# Altium project KEYDIY.PRJPCB
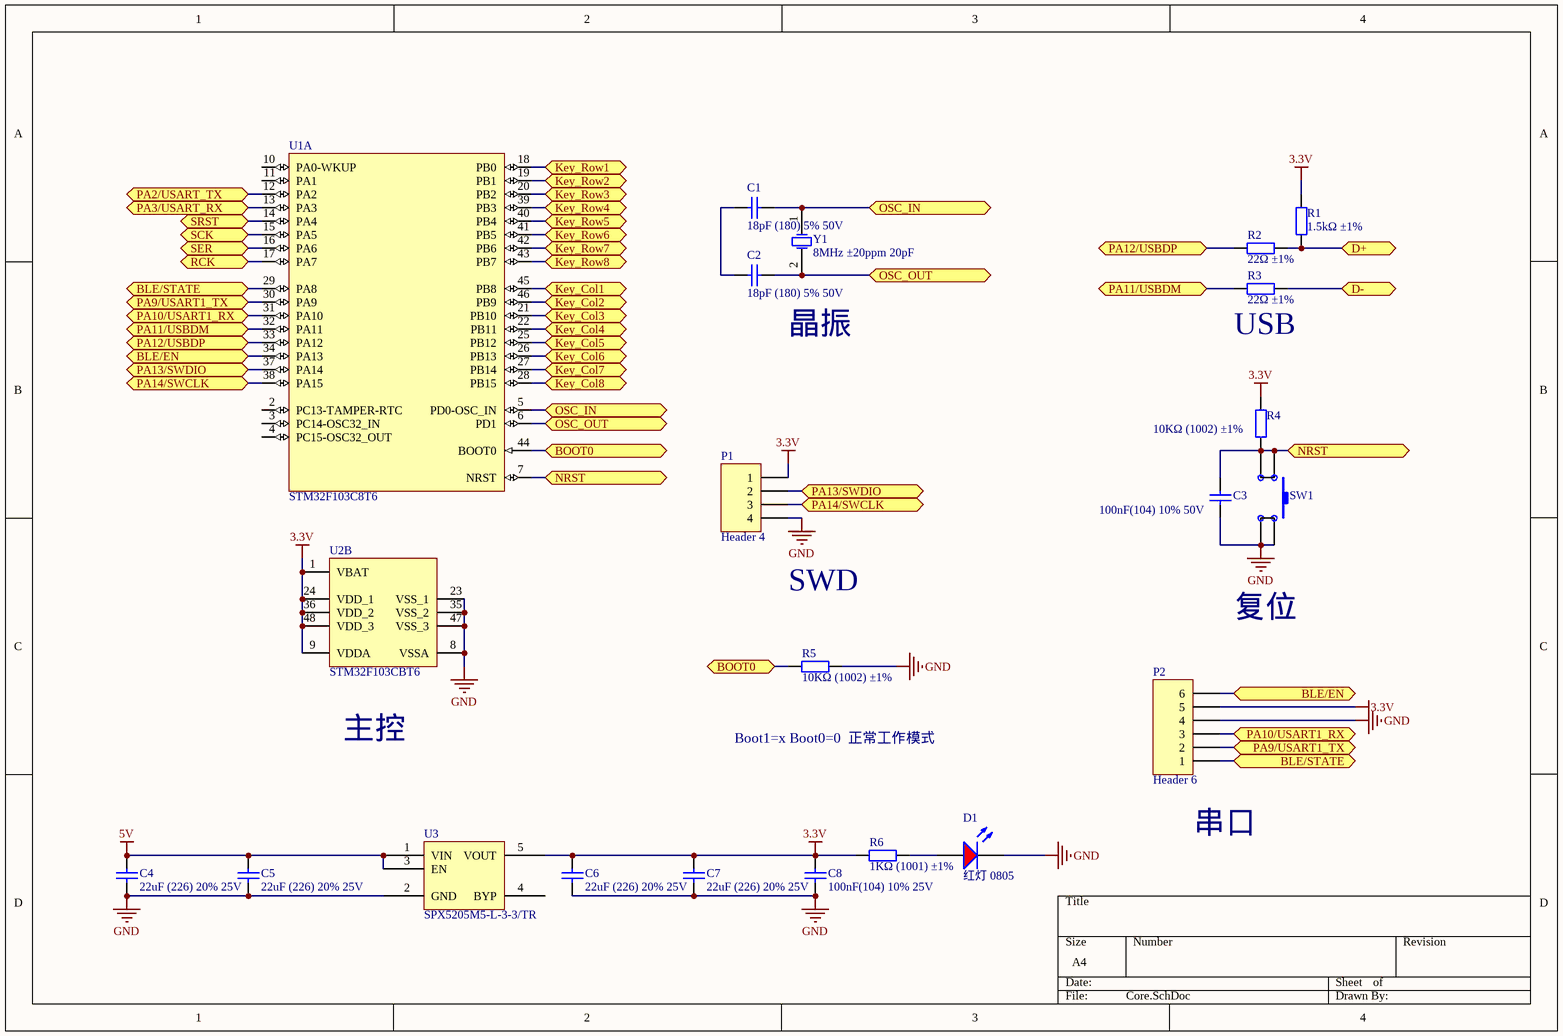
[diagram p0: Core.SchDoc]
2 sheets, 223 parts. Net scope: flat (ports and power ports of the same name join across sheets).
Board file: KeyDiy.PcbDoc
Sheets:
  Core.SchDoc
  KeyDiy.SchDoc

## Sheet Core.SchDoc
size A4

### Parts
(Parts that share a designator on the sheet are numbered #1, #2 ... from top to bottom, then left to right.)
C1  18pF (180) 5% 50V  [0603_C]
C2  18pF (180) 5% 50V  [0603_C]
C3  100nF(104) 10% 50V  [0603_C]
C4  22uF (226) 20% 25V  [0603_C]
C5  22uF (226) 20% 25V  [0603_C]
C6  22uF (226) 20% 25V  [0603_C]
C7  22uF (226) 20% 25V  [0603_C]
C8  100nF(104) 10% 25V  [0603_C]
D1  红灯 0805  [0603_LED_S1]
P1  Header 4  [HDR1X4]
P2#1  Header 6  [HDR1X6]
R1  1.5kΩ ±1%  [0603_R]
R2  22Ω ±1%  [0603_R]
R3  22Ω ±1%  [0603_R]
R4  10KΩ (1002) ±1%  [0603_R]
R5  10KΩ (1002) ±1%  [0603_R]
R6  1KΩ (1001) ±1%  [0603_R]
SW1  button  [KEY4]  (value not drawn)
U1  STM32F103C8T6  [LQFP-48_7x7x05P]  (part A of 2)
U2  STM32F103CBT6  [LQFP-48_7x7x05P]  (part B of 2)
U3  SPX5205M5-L-3-3/TR  [SOT-23-5]
Y1  8MHz ±20ppm 20pF  [SMD-5032_2P]

### Ports
BLE/EN, BLE/STATE, BOOT0, D+, D-, Key_Col1, Key_Col2, Key_Col3, Key_Col4, Key_Col5, Key_Col6, Key_Col7, Key_Col8, Key_Row1, Key_Row2, Key_Row3, Key_Row4, Key_Row5, Key_Row6, Key_Row7, Key_Row8, NRST, OSC_IN, OSC_OUT, PA2/USART_TX, PA3/USART_RX, PA9/USART1_TX, PA10/USART1_RX, PA11/USBDM, PA12/USBDP, PA13/SWDIO, PA14/SWCLK, RCK, SCK, SER, SRST

### Nets
3.3V: C6.2 C7.2 C8.2 P1.1 P2#1.5 R1.1 R4.2 R6.2 U2.1(VBAT) U2.9(VDDA) U2.24(VDD_1) U2.36(VDD_2) U2.48(VDD_3) U3.5(VOUT)
5V: C4.2 C5.2 U3.1(VIN) U3.3(EN)
GND: C3.1 C4.1 C5.1 C6.1 C7.1 C8.1 D1.K P1.4 P2#1.4 R5.2 SW1.3 SW1.4 U2.8(VSSA) U2.23(VSS_1) U2.35(VSS_2) U2.47(VSS_3) U3.2(GND)
NetC1_1: C1.1 U1.5(PD0-OSC_IN) Y1.1(OSC1) ; port OSC_IN
NetC1_2: C1.2 C2.2
NetC2_1: C2.1 U1.6(PD1) Y1.2(OSC2) ; port OSC_OUT
NetC3_2: C3.2 R4.1 SW1.1 SW1.2 U1.7(NRST) ; port NRST
NetD1_A: D1.A R6.1
NetD2_2: U1.18(PB0) ; port Key_Row1
NetD10_2: U1.19(PB1) ; port Key_Row2
NetD18_2: U1.20(PB2) ; port Key_Row3
NetD26_2: U1.39(PB3) ; port Key_Row4
NetD34_2: U1.40(PB4) ; port Key_Row5
NetD42_2: U1.41(PB5) ; port Key_Row6
NetD50_2: U1.42(PB6) ; port Key_Row7
NetD58_2: U1.43(PB7) ; port Key_Row8
NetP1_2: P1.2 U1.37(PA14) ; port PA13/SWDIO
NetP1_3: P1.3 U1.38(PA15) ; port PA14/SWCLK
NetP2#1_1: P2#1.1 U1.29(PA8) ; port BLE/STATE
NetP2#1_2: P2#1.2 U1.30(PA9) ; port PA9/USART1_TX
NetP2#1_3: P2#1.3 U1.31(PA10) ; port PA10/USART1_RX
NetP2#1_6: P2#1.6 U1.34(PA13) ; port BLE/EN
NetP3_2: R3.1 ; port D-
NetP3_3: R1.2 R2.1 ; port D+
NetR2_2: R2.2 U1.33(PA12) ; port PA12/USBDP
NetR3_2: R3.2 U1.32(PA11) ; port PA11/USBDM
NetR5_1: R5.1 U1.44(BOOT0) ; port BOOT0
NetSW2_2: U1.45(PB8) ; port Key_Col1
NetSW3_2: U1.46(PB9) ; port Key_Col2
NetSW4_2: U1.21(PB10) ; port Key_Col3
NetSW5_2: U1.22(PB11) ; port Key_Col4
NetSW6_2: U1.25(PB12) ; port Key_Col5
NetSW7_2: U1.26(PB13) ; port Key_Col6
NetSW8_2: U1.27(PB14) ; port Key_Col7
NetSW9_2: U1.28(PB15) ; port Key_Col8
NetU1_12: U1.12(PA2) ; port PA2/USART_TX
NetU1_13: U1.13(PA3) ; port PA3/USART_RX
NetU1_14: U1.14(PA4) ; port SRST
NetU1_15: U1.15(PA5) ; port SCK
NetU1_16: U1.16(PA6) ; port SER
NetU1_17: U1.17(PA7) ; port RCK

Not connected (* = marked no-connect by the designer): U1 2(PC13-TAMPER-RTC) 3(PC14-OSC32_IN) 4(PC15-OSC32_OUT) 10(PA0-WKUP) 11(PA1); U3 4(BYP)

### Notes on the sheet
- 晶振
- (near R3) USB
- SWD
- 复位
- 主控
- Boot1=x Boot0=0  正常工作模式
- (near P2#1) 串口

### Library data of the parts
C1 C2 = 0603 18pF (180) 5% 50V: 贴片电容; ComponentLink1Description: 供应商链接; ComponentLink1URL: http://www.szlcsc.com/product/details_1999.html; Package: 0603; Supplier: LC; SuppliersPartNumber: C1647
C3 C8 = 0805 100nF(104) 10% 50V: 贴片电容; ComponentLink1Description: 供应商链接; ComponentLink1URL: http://www.szlcsc.com/product/details_50686.html; Package: 0805; Supplier: LC; SuppliersPartNumber: C49678
C4-C7 = 0805 22uF (226) 20% 25V: 贴片电容; ComponentLink1Description: 供应商链接; ComponentLink1URL: http://www.szlcsc.com/product/details_46786.html; Package: 0805; Supplier: LC; SuppliersPartNumber: C45783
D1 = 0805 红灯: 发光二极管; ComponentLink1Description: 供应商链接; ComponentLink1URL: http://www.szlcsc.com/product/details_2668.html; Package: 0805; Supplier: LC; SuppliersPartNumber: C2295
P1 = Header 4: Header, 4-Pin; LatestRevisionDate: 17-Jul-2002; LatestRevisionNote: Re-released for DXP Platform.; Publisher: Altium Limited
P2#1 = Header 6: Header, 6-Pin; LatestRevisionDate: 17-Jul-2002; LatestRevisionNote: Re-released for DXP Platform.; Publisher: Altium Limited
R1-R5 = 0805 10KΩ (1002) 1%: 贴片电阻; ComponentLink1Description: 供应商链接; ComponentLink1URL: http://www.szlcsc.com/product/details_18102.html; Package: 0805; Supplier: LC; SuppliersPartNumber: C17414
R6 = 0805 1KΩ (1001) 1%: 贴片电阻; ComponentLink1Description: 供应商链接; ComponentLink1URL: http://www.szlcsc.com/product/details_18201.html; Package: 0805; Supplier: LC; SuppliersPartNumber: C17513
U1 = STM32F103C8T6: ARM; ComponentLink1Description: 供应商链接; ComponentLink1URL: http://www.szlcsc.com/product/details_9243.html; Package: LQFP-48_7x7x05P; Supplier: LC; SuppliersPartNumber: C8734
U2 = STM32F103CBT6: ARM; ComponentLink1Description: 供应商链接; ComponentLink1URL: http://www.szlcsc.com/product/details_8796.html; Package: LQFP-48_7x7x05P; Supplier: LC; SuppliersPartNumber: C8304
Y1 = SMD-5032_2P 8MHz 20ppm 20pF: 贴片晶振; ComponentLink1Description: 供应商链接; ComponentLink1URL: http://www.szlcsc.com/product/details_117214.html; Package: SMD-5032_2P; Supplier: LC; SuppliersPartNumber: C115962

## Sheet KeyDiy.SchDoc
size A2
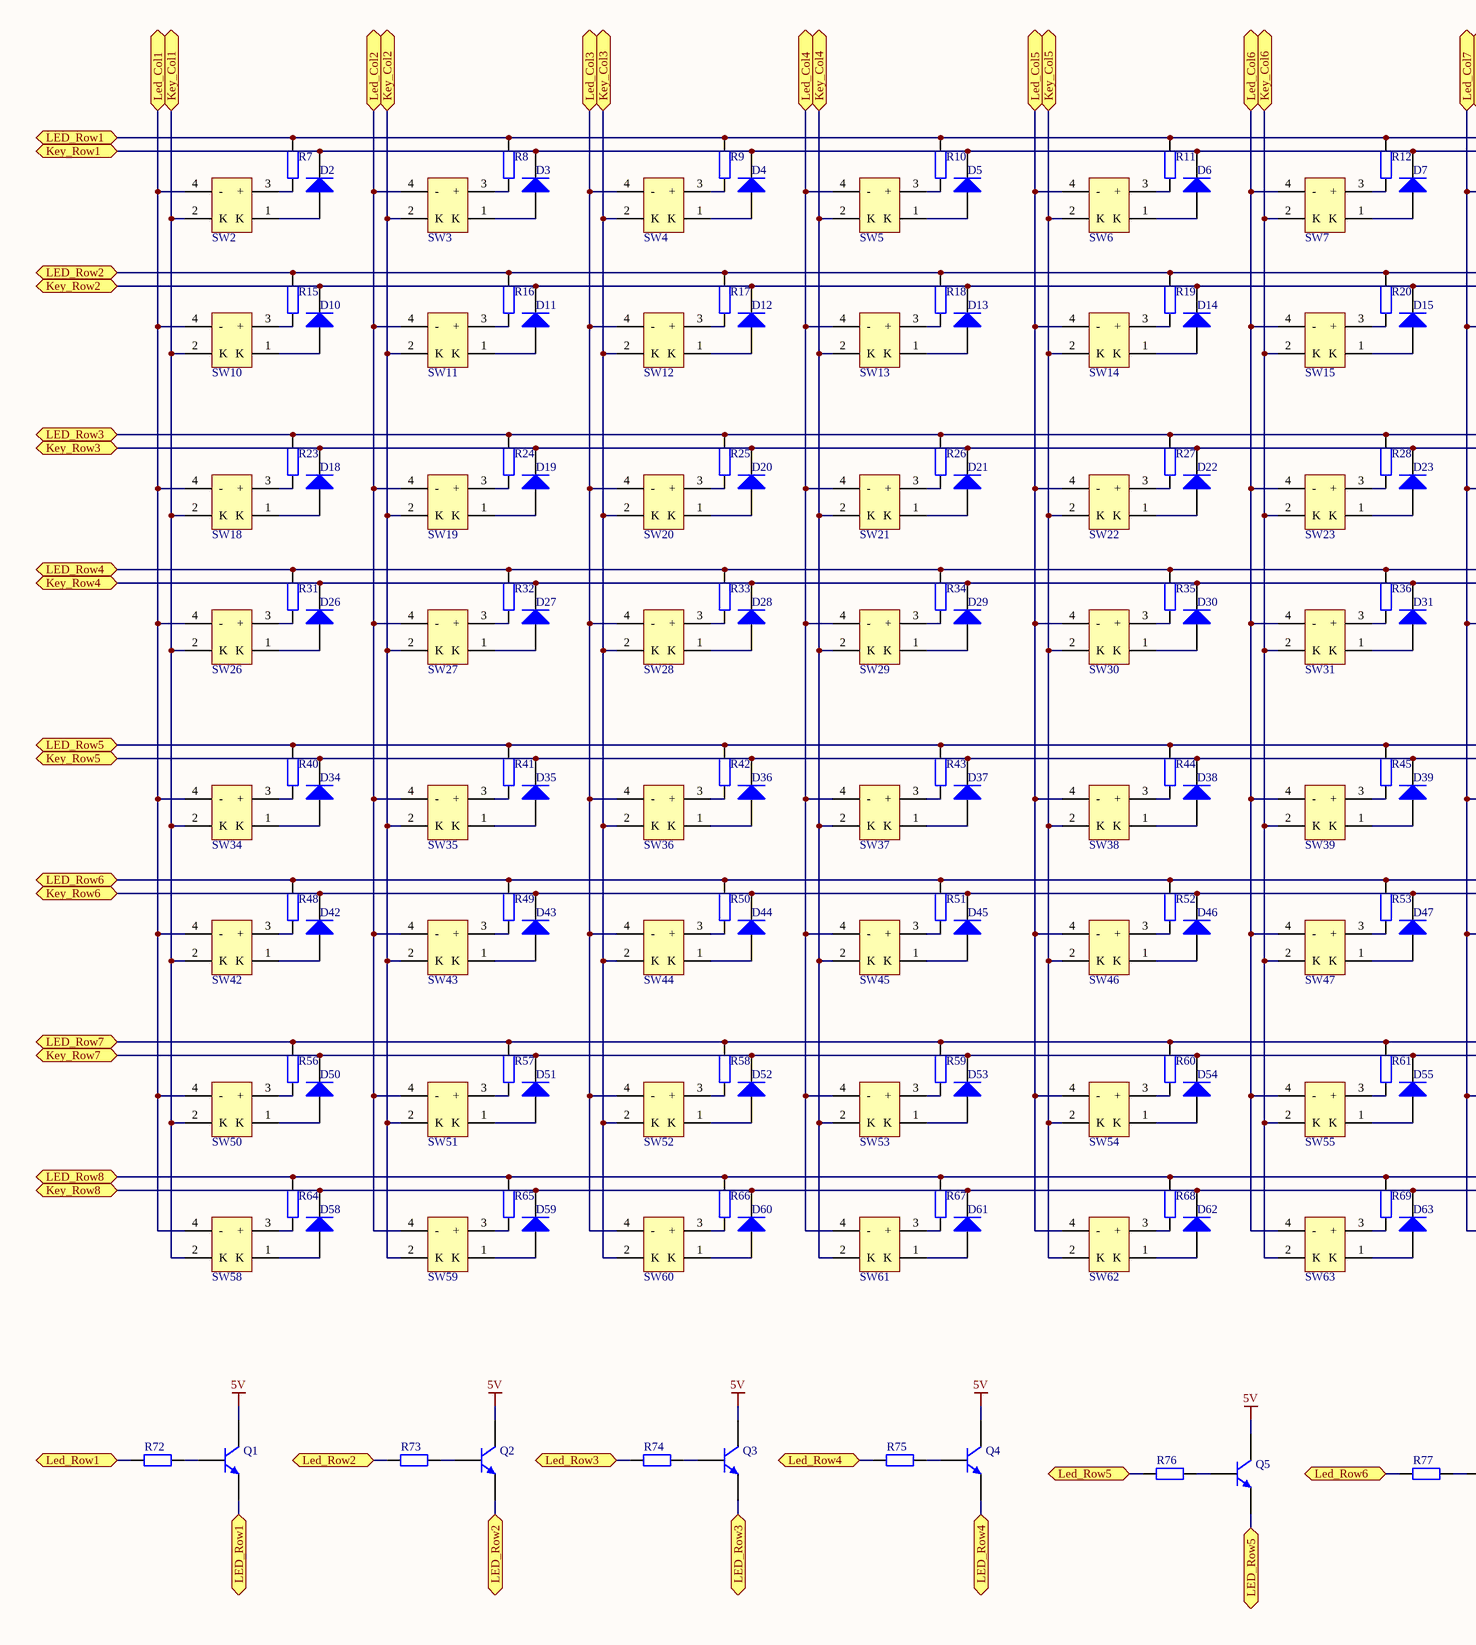
[diagram p1: KeyDiy.SchDoc, left]
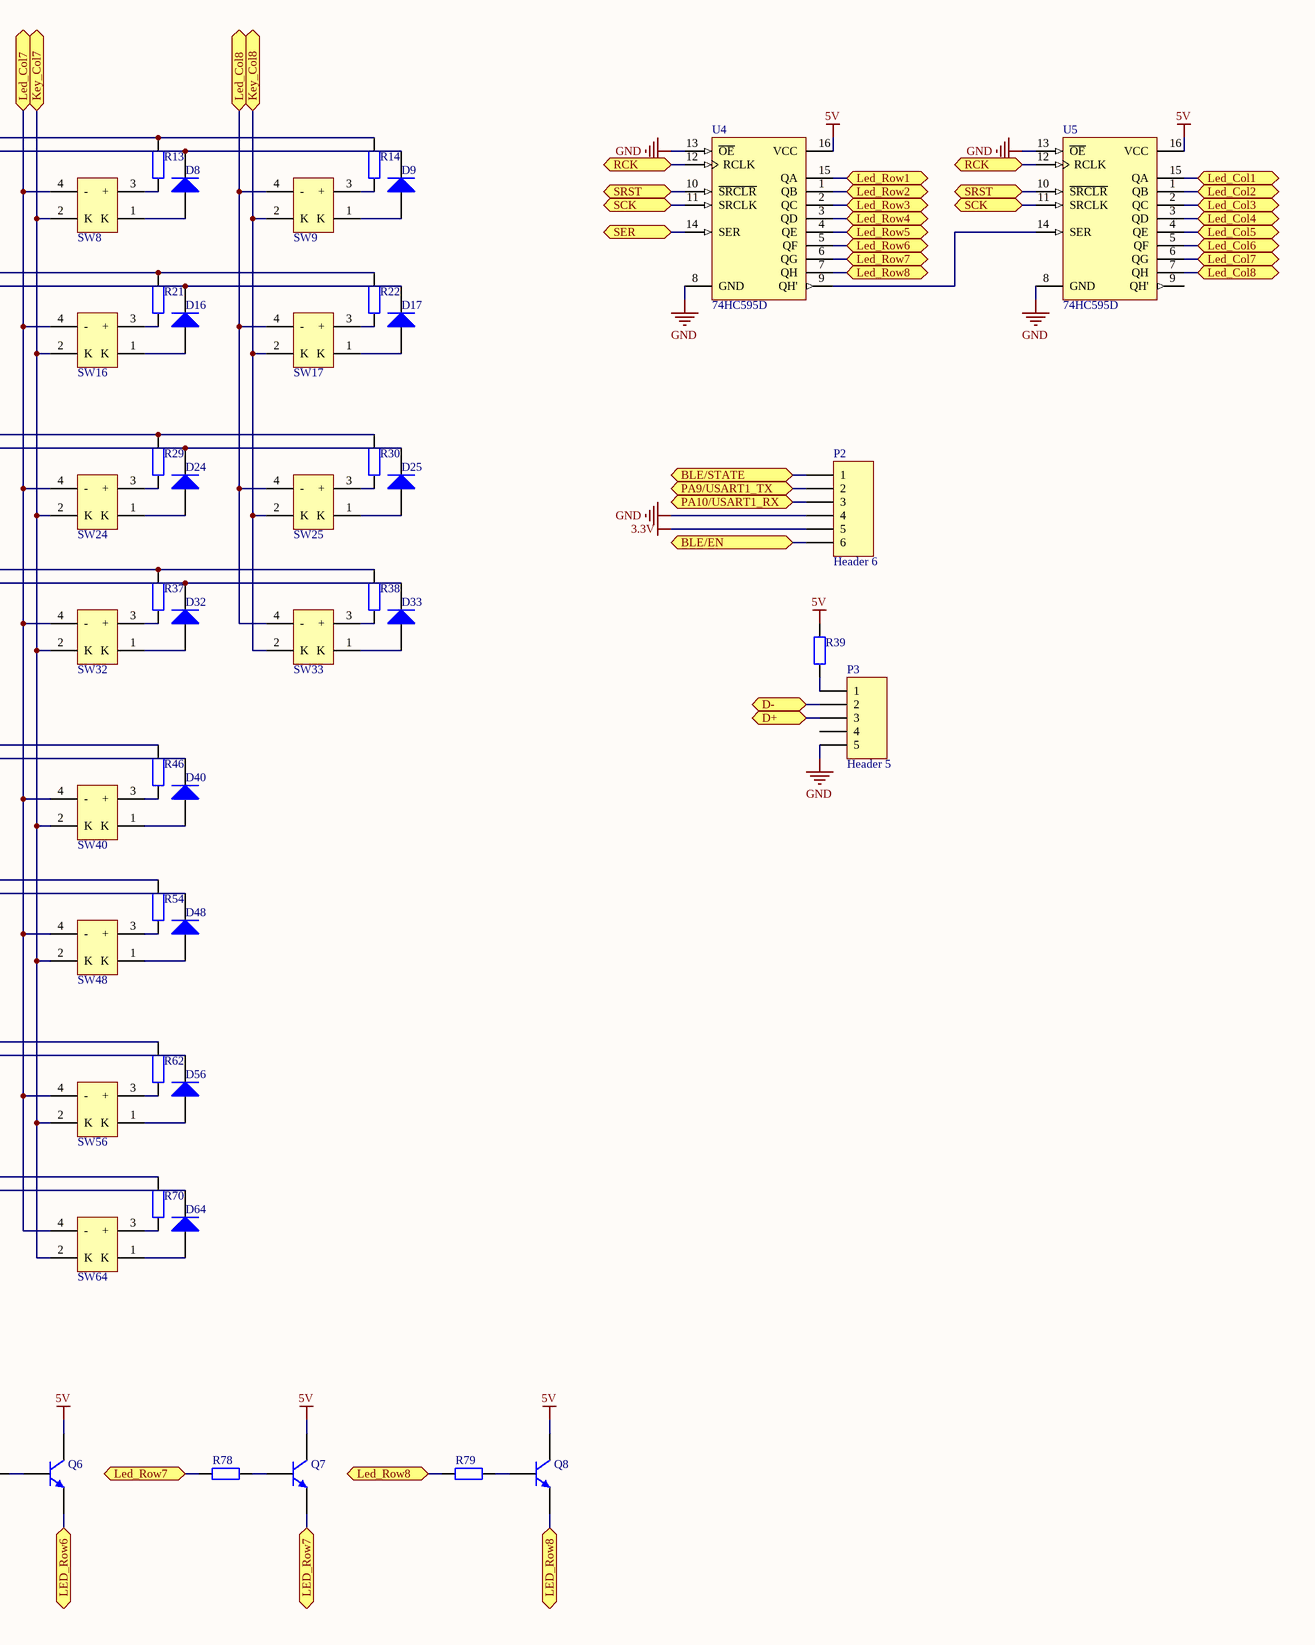
[diagram p2: KeyDiy.SchDoc, right]

### Parts
(Parts that share a designator on the sheet are numbered #1, #2 ... from top to bottom, then left to right.)
D2  1N4148WS T4  [SOD-323]  (value not drawn)
D3  1N4148WS T4  [SOD-323]  (value not drawn)
D4  1N4148WS T4  [SOD-323]  (value not drawn)
D5  1N4148WS T4  [SOD-323]  (value not drawn)
D6  1N4148WS T4  [SOD-323]  (value not drawn)
D7  1N4148WS T4  [SOD-323]  (value not drawn)
D8  1N4148WS T4  [SOD-323]  (value not drawn)
D9  1N4148WS T4  [SOD-323]  (value not drawn)
D10  1N4148WS T4  [SOD-323]  (value not drawn)
D11  1N4148WS T4  [SOD-323]  (value not drawn)
D12  1N4148WS T4  [SOD-323]  (value not drawn)
D13  1N4148WS T4  [SOD-323]  (value not drawn)
D14  1N4148WS T4  [SOD-323]  (value not drawn)
D15  1N4148WS T4  [SOD-323]  (value not drawn)
D16  1N4148WS T4  [SOD-323]  (value not drawn)
D17  1N4148WS T4  [SOD-323]  (value not drawn)
D18  1N4148WS T4  [SOD-323]  (value not drawn)
D19  1N4148WS T4  [SOD-323]  (value not drawn)
D20  1N4148WS T4  [SOD-323]  (value not drawn)
D21  1N4148WS T4  [SOD-323]  (value not drawn)
D22  1N4148WS T4  [SOD-323]  (value not drawn)
D23  1N4148WS T4  [SOD-323]  (value not drawn)
D24  1N4148WS T4  [SOD-323]  (value not drawn)
D25  1N4148WS T4  [SOD-323]  (value not drawn)
D26  1N4148WS T4  [SOD-323]  (value not drawn)
D27  1N4148WS T4  [SOD-323]  (value not drawn)
D28  1N4148WS T4  [SOD-323]  (value not drawn)
D29  1N4148WS T4  [SOD-323]  (value not drawn)
D30  1N4148WS T4  [SOD-323]  (value not drawn)
D31  1N4148WS T4  [SOD-323]  (value not drawn)
D32  1N4148WS T4  [SOD-323]  (value not drawn)
D33  1N4148WS T4  [SOD-323]  (value not drawn)
D34  1N4148WS T4  [SOD-323]  (value not drawn)
D35  1N4148WS T4  [SOD-323]  (value not drawn)
D36  1N4148WS T4  [SOD-323]  (value not drawn)
D37  1N4148WS T4  [SOD-323]  (value not drawn)
D38  1N4148WS T4  [SOD-323]  (value not drawn)
D39  1N4148WS T4  [SOD-323]  (value not drawn)
D40  1N4148WS T4  [SOD-323]  (value not drawn)
D42  1N4148WS T4  [SOD-323]  (value not drawn)
D43  1N4148WS T4  [SOD-323]  (value not drawn)
D44  1N4148WS T4  [SOD-323]  (value not drawn)
D45  1N4148WS T4  [SOD-323]  (value not drawn)
D46  1N4148WS T4  [SOD-323]  (value not drawn)
D47  1N4148WS T4  [SOD-323]  (value not drawn)
D48  1N4148WS T4  [SOD-323]  (value not drawn)
D50  1N4148WS T4  [SOD-323]  (value not drawn)
D51  1N4148WS T4  [SOD-323]  (value not drawn)
D52  1N4148WS T4  [SOD-323]  (value not drawn)
D53  1N4148WS T4  [SOD-323]  (value not drawn)
D54  1N4148WS T4  [SOD-323]  (value not drawn)
D55  1N4148WS T4  [SOD-323]  (value not drawn)
D56  1N4148WS T4  [SOD-323]  (value not drawn)
D58  1N4148WS T4  [SOD-323]  (value not drawn)
D59  1N4148WS T4  [SOD-323]  (value not drawn)
D60  1N4148WS T4  [SOD-323]  (value not drawn)
D61  1N4148WS T4  [SOD-323]  (value not drawn)
D62  1N4148WS T4  [SOD-323]  (value not drawn)
D63  1N4148WS T4  [SOD-323]  (value not drawn)
D64  1N4148WS T4  [SOD-323]  (value not drawn)
P2#2  Header 6  [HDR1X6]
P3  Header 5  [HDR1X5]
Q1  Q  [SOT-23(SOT-23-3)]  (value not drawn)
Q2  Q  [SOT-23(SOT-23-3)]  (value not drawn)
Q3  Q  [SOT-23(SOT-23-3)]  (value not drawn)
Q4  Q  [SOT-23(SOT-23-3)]  (value not drawn)
Q5  Q  [SOT-23(SOT-23-3)]  (value not drawn)
Q6  Q  [SOT-23(SOT-23-3)]  (value not drawn)
Q7  Q  [SOT-23(SOT-23-3)]  (value not drawn)
Q8  Q  [SOT-23(SOT-23-3)]  (value not drawn)
R7  Res2  [0603_R]  (value not drawn)
R8  Res2  [0603_R]  (value not drawn)
R9  Res2  [0603_R]  (value not drawn)
R10  Res2  [0603_R]  (value not drawn)
R11  Res2  [0603_R]  (value not drawn)
R12  Res2  [0603_R]  (value not drawn)
R13  Res2  [0603_R]  (value not drawn)
R14  Res2  [0603_R]  (value not drawn)
R15  Res2  [0603_R]  (value not drawn)
R16  Res2  [0603_R]  (value not drawn)
R17  Res2  [0603_R]  (value not drawn)
R18  Res2  [0603_R]  (value not drawn)
R19  Res2  [0603_R]  (value not drawn)
R20  Res2  [0603_R]  (value not drawn)
R21  Res2  [0603_R]  (value not drawn)
R22  Res2  [0603_R]  (value not drawn)
R23  Res2  [0603_R]  (value not drawn)
R24  Res2  [0603_R]  (value not drawn)
R25  Res2  [0603_R]  (value not drawn)
R26  Res2  [0603_R]  (value not drawn)
R27  Res2  [0603_R]  (value not drawn)
R28  Res2  [0603_R]  (value not drawn)
R29  Res2  [0603_R]  (value not drawn)
R30  Res2  [0603_R]  (value not drawn)
R31  Res2  [0603_R]  (value not drawn)
R32  Res2  [0603_R]  (value not drawn)
R33  Res2  [0603_R]  (value not drawn)
R34  Res2  [0603_R]  (value not drawn)
R35  Res2  [0603_R]  (value not drawn)
R36  Res2  [0603_R]  (value not drawn)
R37  Res2  [0603_R]  (value not drawn)
R38  Res2  [0603_R]  (value not drawn)
R39  Res2  [0603_R]  (value not drawn)
R40  Res2  [0603_R]  (value not drawn)
R41  Res2  [0603_R]  (value not drawn)
R42  Res2  [0603_R]  (value not drawn)
R43  Res2  [0603_R]  (value not drawn)
R44  Res2  [0603_R]  (value not drawn)
R45  Res2  [0603_R]  (value not drawn)
R46  Res2  [0603_R]  (value not drawn)
R48  Res2  [0603_R]  (value not drawn)
R49  Res2  [0603_R]  (value not drawn)
R50  Res2  [0603_R]  (value not drawn)
R51  Res2  [0603_R]  (value not drawn)
R52  Res2  [0603_R]  (value not drawn)
R53  Res2  [0603_R]  (value not drawn)
R54  Res2  [0603_R]  (value not drawn)
R56  Res2  [0603_R]  (value not drawn)
R57  Res2  [0603_R]  (value not drawn)
R58  Res2  [0603_R]  (value not drawn)
R59  Res2  [0603_R]  (value not drawn)
R60  Res2  [0603_R]  (value not drawn)
R61  Res2  [0603_R]  (value not drawn)
R62  Res2  [0603_R]  (value not drawn)
R64  Res2  [0603_R]  (value not drawn)
R65  Res2  [0603_R]  (value not drawn)
R66  Res2  [0603_R]  (value not drawn)
R67  Res2  [0603_R]  (value not drawn)
R68  Res2  [0603_R]  (value not drawn)
R69  Res2  [0603_R]  (value not drawn)
R70  Res2  [0603_R]  (value not drawn)
R72  Res2  [0603_R]  (value not drawn)
R73  Res2  [0603_R]  (value not drawn)
R74  Res2  [0603_R]  (value not drawn)
R75  Res2  [0603_R]  (value not drawn)
R76  Res2  [0603_R]  (value not drawn)
R77  Res2  [0603_R]  (value not drawn)
R78  Res2  [0603_R]  (value not drawn)
R79  Res2  [0603_R]  (value not drawn)
SW2  SW  [MX_SW-5]  (value not drawn)
SW3  SW  [MX_SW-5]  (value not drawn)
SW4  SW  [MX_SW-5]  (value not drawn)
SW5  SW  [MX_SW-5]  (value not drawn)
SW6  SW  [MX_SW-5]  (value not drawn)
SW7  SW  [MX_SW-5]  (value not drawn)
SW8  SW  [MX_SW-5]  (value not drawn)
SW9  SW  [MX_SW-5]  (value not drawn)
SW10  SW  [MX_SW-5]  (value not drawn)
SW11  SW  [MX_SW-5]  (value not drawn)
SW12  SW  [MX_SW-5]  (value not drawn)
SW13  SW  [MX_SW-5]  (value not drawn)
SW14  SW  [MX_SW-5]  (value not drawn)
SW15  SW  [MX_SW-5]  (value not drawn)
SW16  SW  [MX_SW-5]  (value not drawn)
SW17  SW  [MX_SW-5]  (value not drawn)
SW18  SW  [MX_SW-5]  (value not drawn)
SW19  SW  [MX_SW-5]  (value not drawn)
SW20  SW  [MX_SW-5]  (value not drawn)
SW21  SW  [MX_SW-5]  (value not drawn)
SW22  SW  [MX_SW-5]  (value not drawn)
SW23  SW  [MX_SW-5]  (value not drawn)
SW24  SW  [MX_SW-5]  (value not drawn)
SW25  SW  [MX_SW-5]  (value not drawn)
SW26  SW  [MX_SW-5]  (value not drawn)
SW27  SW  [MX_SW-5]  (value not drawn)
SW28  SW  [MX_SW-5]  (value not drawn)
SW29  SW  [MX_SW-5]  (value not drawn)
SW30  SW  [MX_SW-5]  (value not drawn)
SW31  SW  [MX_SW-5]  (value not drawn)
SW32  SW  [MX_SW-5]  (value not drawn)
SW33  SW  [MX_SW-5]  (value not drawn)
SW34  SW  [MX_SW-5]  (value not drawn)
SW35  SW  [MX_SW-5]  (value not drawn)
SW36  SW  [MX_SW-5]  (value not drawn)
SW37  SW  [MX_SW-5]  (value not drawn)
SW38  SW  [MX_SW-5]  (value not drawn)
SW39  SW  [MX_SW-5]  (value not drawn)
SW40  SW  [MX_SW-5]  (value not drawn)
SW42  SW  [MX_SW-5]  (value not drawn)
SW43  SW  [MX_SW-5]  (value not drawn)
SW44  SW  [MX_SW-5]  (value not drawn)
SW45  SW  [MX_SW-5]  (value not drawn)
SW46  SW  [MX_SW-5]  (value not drawn)
SW47  SW  [MX_SW-5]  (value not drawn)
SW48  SW  [MX_SW-5]  (value not drawn)
SW50  SW  [MX_SW-5]  (value not drawn)
SW51  SW  [MX_SW-5]  (value not drawn)
SW52  SW  [MX_SW-5]  (value not drawn)
SW53  SW  [MX_SW-5]  (value not drawn)
SW54  SW  [MX_SW-5]  (value not drawn)
SW55  SW  [MX_SW-5]  (value not drawn)
SW56  SW  [MX_SW-5]  (value not drawn)
SW58  SW  [MX_SW-5]  (value not drawn)
SW59  SW  [MX_SW-5]  (value not drawn)
SW60  SW  [MX_SW-5]  (value not drawn)
SW61  SW  [MX_SW-5]  (value not drawn)
SW62  SW  [MX_SW-5]  (value not drawn)
SW63  SW  [MX_SW-5]  (value not drawn)
SW64  SW  [MX_SW-5]  (value not drawn)
U4  74HC595D  [SOIC-16_150mil]
U5  74HC595D  [SOIC-16_150mil]

### Ports
BLE/EN, BLE/STATE, D+, D-, Key_Col1, Key_Col2, Key_Col3, Key_Col4, Key_Col5, Key_Col6, Key_Col7, Key_Col8, Key_Row1, Key_Row2, Key_Row3, Key_Row4, Key_Row5, Key_Row6, Key_Row7, Key_Row8, Led_Col1, Led_Col2, Led_Col3, Led_Col4, Led_Col5, Led_Col6, Led_Col7, Led_Col8, LED_Row1, Led_Row1, LED_Row2, Led_Row2, LED_Row3, Led_Row3, LED_Row4, Led_Row4, LED_Row5, Led_Row5, LED_Row6, Led_Row6, LED_Row7, Led_Row7, LED_Row8, Led_Row8, PA9/USART1_TX, PA10/USART1_RX, RCK, SCK, SER, SRST

### Nets
3.3V: P2#2.5
5V: Q1.3(C) Q2.3(C) Q3.3(C) Q4.3(C) Q5.3(C) Q6.3(C) Q7.3(C) Q8.3(C) R39.2 U4.16(VCC) U5.16(VCC)
GND: P2#2.4 P3.5 U4.8(GND) U4.13(~{OE}) U5.8(GND) U5.13(~{OE})
NetD2_1: D2.1(A) SW2.1(K)
NetD2_2: D2.2(K) D3.2(K) D4.2(K) D5.2(K) D6.2(K) D7.2(K) D8.2(K) D9.2(K) ; port Key_Row1
NetD3_1: D3.1(A) SW3.1(K)
NetD4_1: D4.1(A) SW4.1(K)
NetD5_1: D5.1(A) SW5.1(K)
NetD6_1: D6.1(A) SW6.1(K)
NetD7_1: D7.1(A) SW7.1(K)
NetD8_1: D8.1(A) SW8.1(K)
NetD9_1: D9.1(A) SW9.1(K)
NetD10_1: D10.1(A) SW10.1(K)
NetD10_2: D10.2(K) D11.2(K) D12.2(K) D13.2(K) D14.2(K) D15.2(K) D16.2(K) D17.2(K) ; port Key_Row2
NetD11_1: D11.1(A) SW11.1(K)
NetD12_1: D12.1(A) SW12.1(K)
NetD13_1: D13.1(A) SW13.1(K)
NetD14_1: D14.1(A) SW14.1(K)
NetD15_1: D15.1(A) SW15.1(K)
NetD16_1: D16.1(A) SW16.1(K)
NetD17_1: D17.1(A) SW17.1(K)
NetD18_1: D18.1(A) SW18.1(K)
NetD18_2: D18.2(K) D19.2(K) D20.2(K) D21.2(K) D22.2(K) D23.2(K) D24.2(K) D25.2(K) ; port Key_Row3
NetD19_1: D19.1(A) SW19.1(K)
NetD20_1: D20.1(A) SW20.1(K)
NetD21_1: D21.1(A) SW21.1(K)
NetD22_1: D22.1(A) SW22.1(K)
NetD23_1: D23.1(A) SW23.1(K)
NetD24_1: D24.1(A) SW24.1(K)
NetD25_1: D25.1(A) SW25.1(K)
NetD26_1: D26.1(A) SW26.1(K)
NetD26_2: D26.2(K) D27.2(K) D28.2(K) D29.2(K) D30.2(K) D31.2(K) D32.2(K) D33.2(K) ; port Key_Row4
NetD27_1: D27.1(A) SW27.1(K)
NetD28_1: D28.1(A) SW28.1(K)
NetD29_1: D29.1(A) SW29.1(K)
NetD30_1: D30.1(A) SW30.1(K)
NetD31_1: D31.1(A) SW31.1(K)
NetD32_1: D32.1(A) SW32.1(K)
NetD33_1: D33.1(A) SW33.1(K)
NetD34_1: D34.1(A) SW34.1(K)
NetD34_2: D34.2(K) D35.2(K) D36.2(K) D37.2(K) D38.2(K) D39.2(K) D40.2(K) ; port Key_Row5
NetD35_1: D35.1(A) SW35.1(K)
NetD36_1: D36.1(A) SW36.1(K)
NetD37_1: D37.1(A) SW37.1(K)
NetD38_1: D38.1(A) SW38.1(K)
NetD39_1: D39.1(A) SW39.1(K)
NetD40_1: D40.1(A) SW40.1(K)
NetD42_1: D42.1(A) SW42.1(K)
NetD42_2: D42.2(K) D43.2(K) D44.2(K) D45.2(K) D46.2(K) D47.2(K) D48.2(K) ; port Key_Row6
NetD43_1: D43.1(A) SW43.1(K)
NetD44_1: D44.1(A) SW44.1(K)
NetD45_1: D45.1(A) SW45.1(K)
NetD46_1: D46.1(A) SW46.1(K)
NetD47_1: D47.1(A) SW47.1(K)
NetD48_1: D48.1(A) SW48.1(K)
NetD50_1: D50.1(A) SW50.1(K)
NetD50_2: D50.2(K) D51.2(K) D52.2(K) D53.2(K) D54.2(K) D55.2(K) D56.2(K) ; port Key_Row7
NetD51_1: D51.1(A) SW51.1(K)
NetD52_1: D52.1(A) SW52.1(K)
NetD53_1: D53.1(A) SW53.1(K)
NetD54_1: D54.1(A) SW54.1(K)
NetD55_1: D55.1(A) SW55.1(K)
NetD56_1: D56.1(A) SW56.1(K)
NetD58_1: D58.1(A) SW58.1(K)
NetD58_2: D58.2(K) D59.2(K) D60.2(K) D61.2(K) D62.2(K) D63.2(K) D64.2(K) ; port Key_Row8
NetD59_1: D59.1(A) SW59.1(K)
NetD60_1: D60.1(A) SW60.1(K)
NetD61_1: D61.1(A) SW61.1(K)
NetD62_1: D62.1(A) SW62.1(K)
NetD63_1: D63.1(A) SW63.1(K)
NetD64_1: D64.1(A) SW64.1(K)
NetP2#1_1: P2#2.1 ; port BLE/STATE
NetP2#1_2: P2#2.2 ; port PA9/USART1_TX
NetP2#1_3: P2#2.3 ; port PA10/USART1_RX
NetP2#1_6: P2#2.6 ; port BLE/EN
NetP3_1: P3.1 R39.1
NetP3_2: P3.2 ; port D-
NetP3_3: P3.3 ; port D+
NetQ1_1: Q1.1(B) R72.1
NetQ1_2: Q1.2(E) R7.2 R8.2 R9.2 R10.2 R11.2 R12.2 R13.2 R14.2 R72.2 U4.15(QA) ; port LED_Row1, port Led_Row1
NetQ2_1: Q2.1(B) R73.1
NetQ2_2: Q2.2(E) R15.2 R16.2 R17.2 R18.2 R19.2 R20.2 R21.2 R22.2 R73.2 U4.1(QB) ; port LED_Row2, port Led_Row2
NetQ3_1: Q3.1(B) R74.1
NetQ3_2: Q3.2(E) R23.2 R24.2 R25.2 R26.2 R27.2 R28.2 R29.2 R30.2 R74.2 U4.2(QC) ; port LED_Row3, port Led_Row3
NetQ4_1: Q4.1(B) R75.1
NetQ4_2: Q4.2(E) R31.2 R32.2 R33.2 R34.2 R35.2 R36.2 R37.2 R38.2 R75.2 U4.3(QD) ; port LED_Row4, port Led_Row4
NetQ5_1: Q5.1(B) R76.1
NetQ5_2: Q5.2(E) R40.2 R41.2 R42.2 R43.2 R44.2 R45.2 R46.2 R76.2 U4.4(QE) ; port LED_Row5, port Led_Row5
NetQ6_1: Q6.1(B) R77.1
NetQ6_2: Q6.2(E) R48.2 R49.2 R50.2 R51.2 R52.2 R53.2 R54.2 R77.2 U4.5(QF) ; port LED_Row6, port Led_Row6
NetQ7_1: Q7.1(B) R78.1
NetQ7_2: Q7.2(E) R56.2 R57.2 R58.2 R59.2 R60.2 R61.2 R62.2 R78.2 U4.6(QG) ; port LED_Row7, port Led_Row7
NetQ8_1: Q8.1(B) R79.1
NetQ8_2: Q8.2(E) R64.2 R65.2 R66.2 R67.2 R68.2 R69.2 R70.2 R79.2 U4.7(QH) ; port LED_Row8, port Led_Row8
NetR7_1: R7.1 SW2.3(+)
NetR8_1: R8.1 SW3.3(+)
NetR9_1: R9.1 SW4.3(+)
NetR10_1: R10.1 SW5.3(+)
NetR11_1: R11.1 SW6.3(+)
NetR12_1: R12.1 SW7.3(+)
NetR13_1: R13.1 SW8.3(+)
NetR14_1: R14.1 SW9.3(+)
NetR15_1: R15.1 SW10.3(+)
NetR16_1: R16.1 SW11.3(+)
NetR17_1: R17.1 SW12.3(+)
NetR18_1: R18.1 SW13.3(+)
NetR19_1: R19.1 SW14.3(+)
NetR20_1: R20.1 SW15.3(+)
NetR21_1: R21.1 SW16.3(+)
NetR22_1: R22.1 SW17.3(+)
NetR23_1: R23.1 SW18.3(+)
NetR24_1: R24.1 SW19.3(+)
NetR25_1: R25.1 SW20.3(+)
NetR26_1: R26.1 SW21.3(+)
NetR27_1: R27.1 SW22.3(+)
NetR28_1: R28.1 SW23.3(+)
NetR29_1: R29.1 SW24.3(+)
NetR30_1: R30.1 SW25.3(+)
NetR31_1: R31.1 SW26.3(+)
NetR32_1: R32.1 SW27.3(+)
NetR33_1: R33.1 SW28.3(+)
NetR34_1: R34.1 SW29.3(+)
NetR35_1: R35.1 SW30.3(+)
NetR36_1: R36.1 SW31.3(+)
NetR37_1: R37.1 SW32.3(+)
NetR38_1: R38.1 SW33.3(+)
NetR40_1: R40.1 SW34.3(+)
NetR41_1: R41.1 SW35.3(+)
NetR42_1: R42.1 SW36.3(+)
NetR43_1: R43.1 SW37.3(+)
NetR44_1: R44.1 SW38.3(+)
NetR45_1: R45.1 SW39.3(+)
NetR46_1: R46.1 SW40.3(+)
NetR48_1: R48.1 SW42.3(+)
NetR49_1: R49.1 SW43.3(+)
NetR50_1: R50.1 SW44.3(+)
NetR51_1: R51.1 SW45.3(+)
NetR52_1: R52.1 SW46.3(+)
NetR53_1: R53.1 SW47.3(+)
NetR54_1: R54.1 SW48.3(+)
NetR56_1: R56.1 SW50.3(+)
NetR57_1: R57.1 SW51.3(+)
NetR58_1: R58.1 SW52.3(+)
NetR59_1: R59.1 SW53.3(+)
NetR60_1: R60.1 SW54.3(+)
NetR61_1: R61.1 SW55.3(+)
NetR62_1: R62.1 SW56.3(+)
NetR64_1: R64.1 SW58.3(+)
NetR65_1: R65.1 SW59.3(+)
NetR66_1: R66.1 SW60.3(+)
NetR67_1: R67.1 SW61.3(+)
NetR68_1: R68.1 SW62.3(+)
NetR69_1: R69.1 SW63.3(+)
NetR70_1: R70.1 SW64.3(+)
NetSW2_2: SW2.2(K) SW10.2(K) SW18.2(K) SW26.2(K) SW34.2(K) SW42.2(K) SW50.2(K) SW58.2(K) ; port Key_Col1
NetSW2_4: SW2.4(-) SW10.4(-) SW18.4(-) SW26.4(-) SW34.4(-) SW42.4(-) SW50.4(-) SW58.4(-) U5.15(QA) ; port Led_Col1
NetSW3_2: SW3.2(K) SW11.2(K) SW19.2(K) SW27.2(K) SW35.2(K) SW43.2(K) SW51.2(K) SW59.2(K) ; port Key_Col2
NetSW3_4: SW3.4(-) SW11.4(-) SW19.4(-) SW27.4(-) SW35.4(-) SW43.4(-) SW51.4(-) SW59.4(-) U5.1(QB) ; port Led_Col2
NetSW4_2: SW4.2(K) SW12.2(K) SW20.2(K) SW28.2(K) SW36.2(K) SW44.2(K) SW52.2(K) SW60.2(K) ; port Key_Col3
NetSW4_4: SW4.4(-) SW12.4(-) SW20.4(-) SW28.4(-) SW36.4(-) SW44.4(-) SW52.4(-) SW60.4(-) U5.2(QC) ; port Led_Col3
NetSW5_2: SW5.2(K) SW13.2(K) SW21.2(K) SW29.2(K) SW37.2(K) SW45.2(K) SW53.2(K) SW61.2(K) ; port Key_Col4
NetSW5_4: SW5.4(-) SW13.4(-) SW21.4(-) SW29.4(-) SW37.4(-) SW45.4(-) SW53.4(-) SW61.4(-) U5.3(QD) ; port Led_Col4
NetSW6_2: SW6.2(K) SW14.2(K) SW22.2(K) SW30.2(K) SW38.2(K) SW46.2(K) SW54.2(K) SW62.2(K) ; port Key_Col5
NetSW6_4: SW6.4(-) SW14.4(-) SW22.4(-) SW30.4(-) SW38.4(-) SW46.4(-) SW54.4(-) SW62.4(-) U5.4(QE) ; port Led_Col5
NetSW7_2: SW7.2(K) SW15.2(K) SW23.2(K) SW31.2(K) SW39.2(K) SW47.2(K) SW55.2(K) SW63.2(K) ; port Key_Col6
NetSW7_4: SW7.4(-) SW15.4(-) SW23.4(-) SW31.4(-) SW39.4(-) SW47.4(-) SW55.4(-) SW63.4(-) U5.5(QF) ; port Led_Col6
NetSW8_2: SW8.2(K) SW16.2(K) SW24.2(K) SW32.2(K) SW40.2(K) SW48.2(K) SW56.2(K) SW64.2(K) ; port Key_Col7
NetSW8_4: SW8.4(-) SW16.4(-) SW24.4(-) SW32.4(-) SW40.4(-) SW48.4(-) SW56.4(-) SW64.4(-) U5.6(QG) ; port Led_Col7
NetSW9_2: SW9.2(K) SW17.2(K) SW25.2(K) SW33.2(K) ; port Key_Col8
NetSW9_4: SW9.4(-) SW17.4(-) SW25.4(-) SW33.4(-) U5.7(QH) ; port Led_Col8
NetU1_14: U4.10(~{SRCLR}) U5.10(~{SRCLR}) ; port SRST
NetU1_15: U4.11(SRCLK) U5.11(SRCLK) ; port SCK
NetU1_16: U4.14(SER) ; port SER
NetU1_17: U4.12(RCLK) U5.12(RCLK) ; port RCK
NetU4_9: U4.9(QH') U5.14(SER)

Not connected (* = marked no-connect by the designer): P3 4; U5 9(QH')

### Library data of the parts
D2-D40 D42-D48 D50-D56 D58-D64 = SOD-323 1N4148WS T4: 二极管; ComponentLink1Description: 供应商链接; ComponentLink1URL: http://www.szlcsc.com/product/details_2485.html; Package: SOD-323; Supplier: LC; SuppliersPartNumber: C2128
P2#2 = Header 6: Header, 6-Pin; LatestRevisionDate: 17-Jul-2002; LatestRevisionNote: Re-released for DXP Platform.; Publisher: Altium Limited
P3 = Header 5: Header, 5-Pin; LatestRevisionDate: 17-Jul-2002; LatestRevisionNote: Re-released for DXP Platform.; Publisher: Altium Limited
Q1-Q8 = NPN(S8050)
R7-R38 R40-R46 R48-R54 R56-R62 R64-R70 = Res2: Resistor; Value: 330; Published: 8-Jun-2000; LatestRevisionDate: 17-Jul-2002; LatestRevisionNote: Re-released for DXP Platform.; PackageReference: AXIAL-0.4; Publisher: Altium Limited
R39 = Res2: Resistor; Value: 0; Published: 8-Jun-2000; LatestRevisionDate: 17-Jul-2002; LatestRevisionNote: Re-released for DXP Platform.; PackageReference: AXIAL-0.4; Publisher: Altium Limited
R72-R79 = Res2: Resistor; Value: 500; Published: 8-Jun-2000; LatestRevisionDate: 17-Jul-2002; LatestRevisionNote: Re-released for DXP Platform.; PackageReference: AXIAL-0.4; Publisher: Altium Limited
SW2-SW40 SW42-SW48 SW50-SW56 SW58-SW64 = Cherry
U4 U5 = 74HC595D_[C5947]: 74系列逻辑芯片; ComponentLink1Description: 供应商链接; ComponentLink1URL: http://www.szlcsc.com/product/details_6413.html; Package: SOIC-16_150mil; Supplier: LC; SuppliersPartNumber: C5947

## Nets that join several sheets
3.3V: Core (14 pins), KeyDiy (P2#2.5)
5V: Core (C4.2 C5.2 U3.1 U3.3), KeyDiy (11 pins)
GND: Core (17 pins), KeyDiy (6 pins)
NetD2_2: Core (U1.18), KeyDiy (8 pins)
NetD10_2: Core (U1.19), KeyDiy (8 pins)
NetD18_2: Core (U1.20), KeyDiy (8 pins)
NetD26_2: Core (U1.39), KeyDiy (8 pins)
NetD34_2: Core (U1.40), KeyDiy (7 pins)
NetD42_2: Core (U1.41), KeyDiy (7 pins)
NetD50_2: Core (U1.42), KeyDiy (7 pins)
NetD58_2: Core (U1.43), KeyDiy (7 pins)
NetP2#1_1: Core (P2#1.1 U1.29), KeyDiy (P2#2.1)
NetP2#1_2: Core (P2#1.2 U1.30), KeyDiy (P2#2.2)
NetP2#1_3: Core (P2#1.3 U1.31), KeyDiy (P2#2.3)
NetP2#1_6: Core (P2#1.6 U1.34), KeyDiy (P2#2.6)
NetP3_2: Core (R3.1), KeyDiy (P3.2)
NetP3_3: Core (R1.2 R2.1), KeyDiy (P3.3)
NetSW2_2: Core (U1.45), KeyDiy (8 pins)
NetSW3_2: Core (U1.46), KeyDiy (8 pins)
NetSW4_2: Core (U1.21), KeyDiy (8 pins)
NetSW5_2: Core (U1.22), KeyDiy (8 pins)
NetSW6_2: Core (U1.25), KeyDiy (8 pins)
NetSW7_2: Core (U1.26), KeyDiy (8 pins)
NetSW8_2: Core (U1.27), KeyDiy (8 pins)
NetSW9_2: Core (U1.28), KeyDiy (SW9.2 SW17.2 SW25.2 SW33.2)
NetU1_14: Core (U1.14), KeyDiy (U4.10 U5.10)
NetU1_15: Core (U1.15), KeyDiy (U4.11 U5.11)
NetU1_16: Core (U1.16), KeyDiy (U4.14)
NetU1_17: Core (U1.17), KeyDiy (U4.12 U5.12)